# EAGLE design giraffe_mx5 (EAGLE 8.5.0)
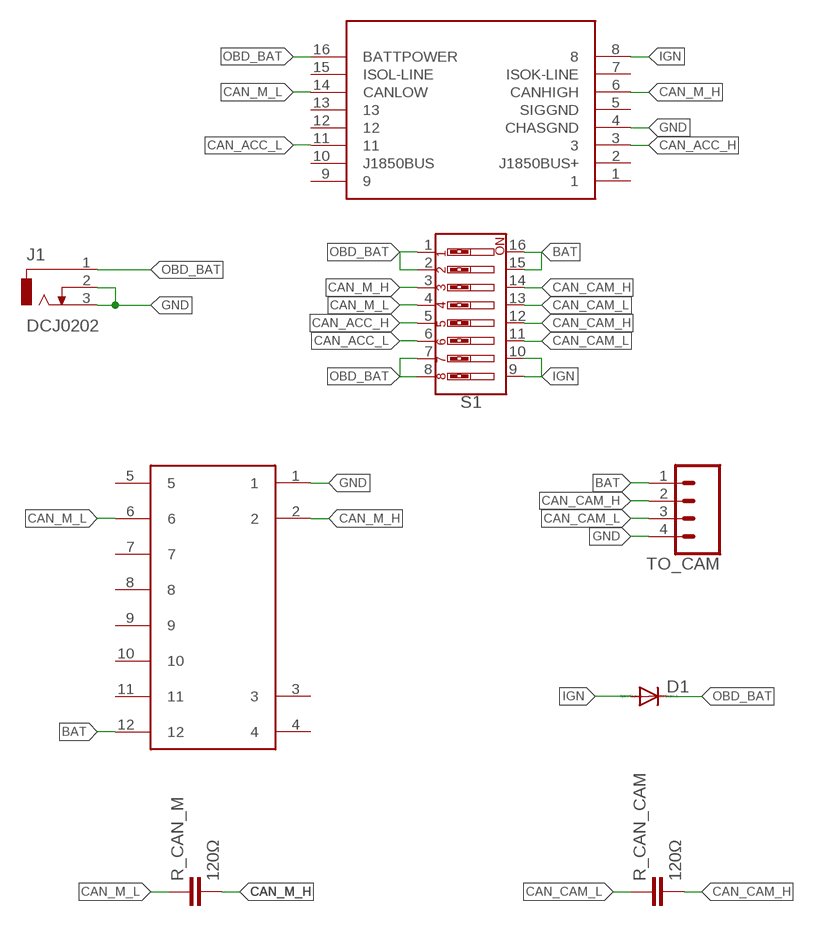
[diagram p0: schematic, sheet 1]

## Parts
D1  DIODE-DO-214AC  [DO-214AC]
J1  DCJ0202  [DCJ0202]
OBD_II  OBDII  [OBDII]
R_CAN_CAM  120Ω  C-EUC1206  [C1206]
R_CAN_M  120Ω  C-EUC1206  [C1206]
S1  DIP-08-PTH  [DIPSWITCH-08]
TO_CAM  CONN_04LONGPADS  [1X04_LONGPADS]
TO_CAR  34826-8124  [34826-8124]

## Nets
BAT: S1.15 S1.16 TO_CAM.1 TO_CAR.12
CAN_ACC_H: OBD_II.3 S1.5
CAN_ACC_L: OBD_II.11 S1.6
CAN_CAM_H: R_CAN_CAM.2 S1.12 S1.14 TO_CAM.2
CAN_CAM_L: R_CAN_CAM.1 S1.11 S1.13 TO_CAM.3
CAN_M_H: OBD_II.6(CANHIGH) R_CAN_M.2 S1.3 TO_CAR.2
CAN_M_L: OBD_II.14(CANLOW) R_CAN_M.1 S1.4 TO_CAR.6
GND: J1.2 J1.3 OBD_II.4(CHASGND) TO_CAM.4 TO_CAR.1
IGN: D1.A OBD_II.8 S1.9 S1.10
OBD_BAT: D1.C J1.1 OBD_II.16(BATTPOWER) S1.1 S1.2 S1.7 S1.8
Unconnected: OBD_II.1 OBD_II.2(J1850BUS+) OBD_II.5(SIGGND) OBD_II.7(ISOK-LINE) OBD_II.9 OBD_II.10(J1850BUS) OBD_II.12 OBD_II.13 OBD_II.15(ISOL-LINE) TO_CAR.3 TO_CAR.4 TO_CAR.5 TO_CAR.7 TO_CAR.8 TO_CAR.9 TO_CAR.10 TO_CAR.11

## Library data of the parts
D1 = diode:DIODE-: DIODE
J1 = con-jack:DCJ0202: DC POWER JACK Source: DCJ0202.pdf; OC_FARNELL: unknown; OC_NEWARK: unknown
OBD_II = SparkFun-Connectors:OBDII: OBD-II Connector OBDII is an on board diagnostics standard that is used on a large variety of cars. Here is the connector we sell at SparkFun: OBD-II connector <https://www.sparkfun.com/products/9911> (DEV-09911) Info and Pinout <http://pinoutsguide.com/CarElectronics/car_obd2_pinout.shtml> (sorry, no datasheet) We do not use this connector on any active designs, however, if you're looking for OBDII tech, please check out these: SparkFun OBD related products <https://www.sparkfun.com/search/results?term=obd>; SF_ID: DEV-09911
R_CAN_CAM R_CAN_M = resistor:C-EU: CAPACITOR, European symbol
S1 = SparkFun-Switches:DIP-08: 8-Position DIP Switch 8-circuit DIP (dual inline package) switch. Commonly used to physcially set a circuit's behavior. SparkFun Products DIP Switch - 8 Position <https://www.sparkfun.com/products/8034> (COM-08034); PROD_ID: SWCH-12197; SF_SKU: COM-08034
TO_CAM = SparkFun-Connectors:CONN_04: Multi connection point. Often used as Generic Header-pin footprint for 0.1 inch spaced/style header connections On any of the 0.1 inch spaced packages, you can populate with these: Break Away Headers - Straight <https://www.sparkfun.com/products/116> (PRT-00116) Break Away Male Headers - Right Angle <https://www.sparkfun.com/products/553> (PRT-00553) Female Headers <https://www.sparkfun.com/products/115> (PRT-00115) Break Away Headers - Machine Pin <https://www.sparkfun.com/products/117> (PRT-00117) Break Away Female Headers - Swiss Machine Pin <https://www.sparkfun.com/products/743> (PRT-00743) For SCREWTERMINALS and SPRING TERMINALS visit here: Screw Terimnals on SparkFun.com <https://www.sparkfun.com/search/results?term=Screw+Terminals> (5mm/3.5mm/2.54mm spacing) This device is also useful as a general connection point to wire up your design to another part of your project. Our various solder wires solder well into these plated through hole pads. Hook-Up Wire - Assortment (Stranded, 22 AWG) <https://www.sparkfun.com/products/11375> (PRT-11375) Hook-Up Wire - Assortment (Solid Core, 22 AWG) <https://www.sparkfun.com/products/11367> (PRT-11367) View the entire wire category on our website here <https://www.sparkfun.com/categories/141> Special notes: Molex polarized connector foot print use with SKU : PRT-08231 with associated crimp pins and housings. 1MM SMD Version SKU: PRT-10208; PROD_ID: CONN-09696
TO_CAR = Mini50:34826-8124

## Net classes
0 default: width 0.305 mm, clearance 0.305 mm

## Board
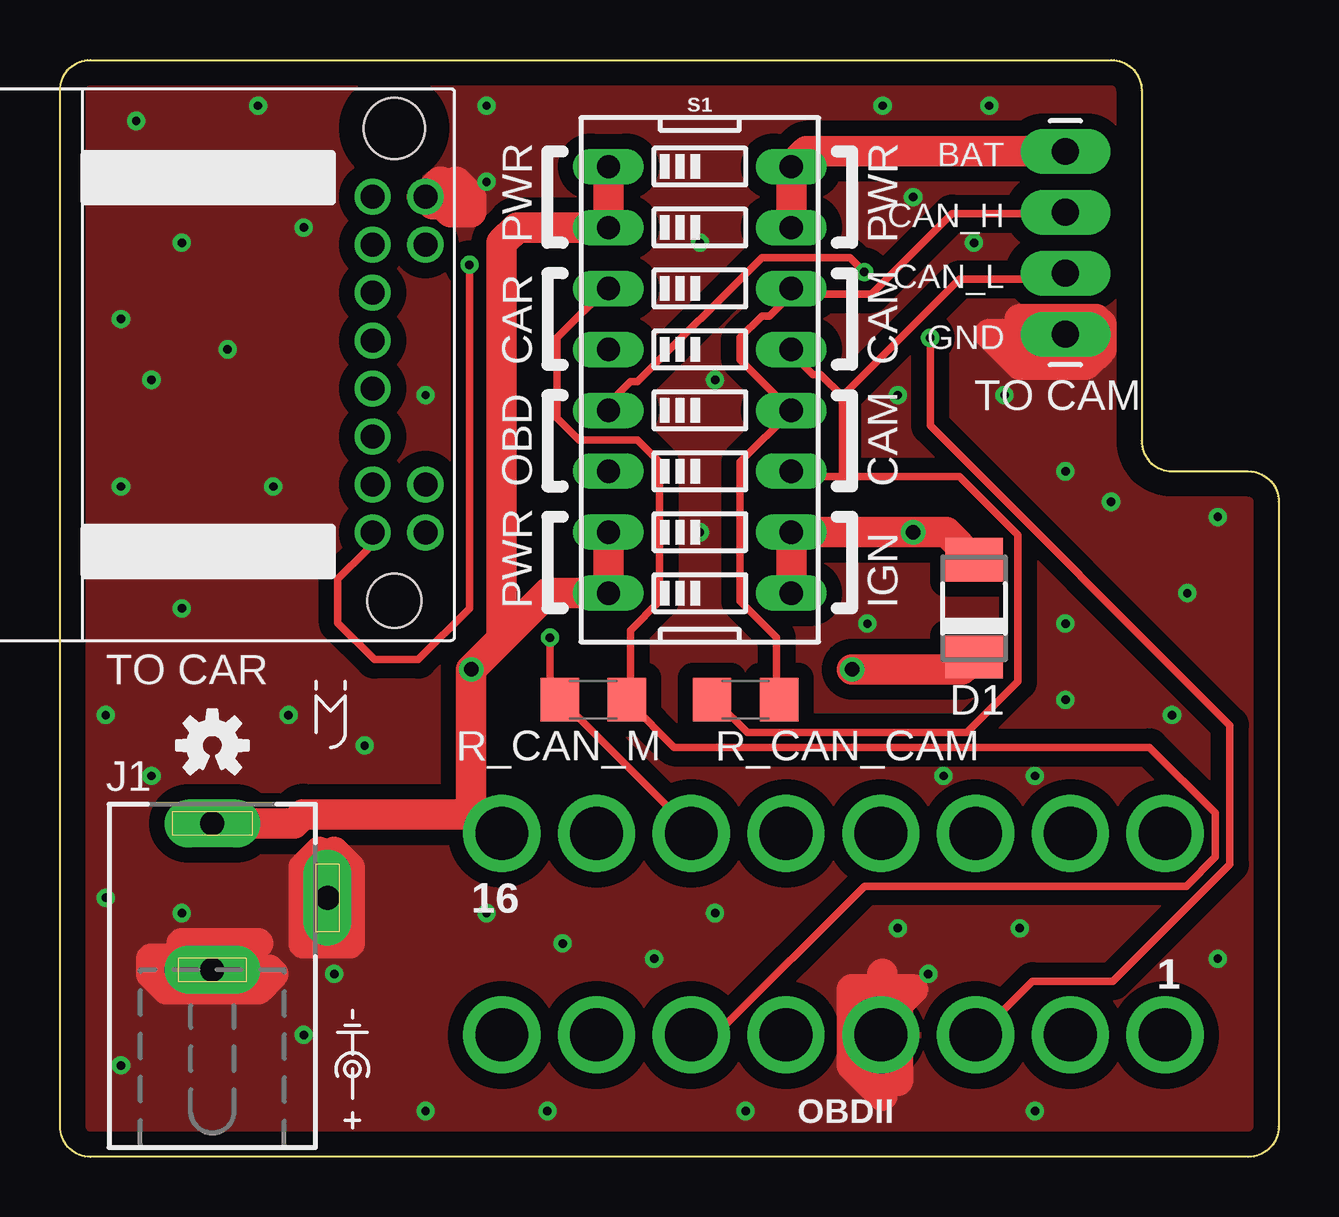
[diagram p1: board, top side]
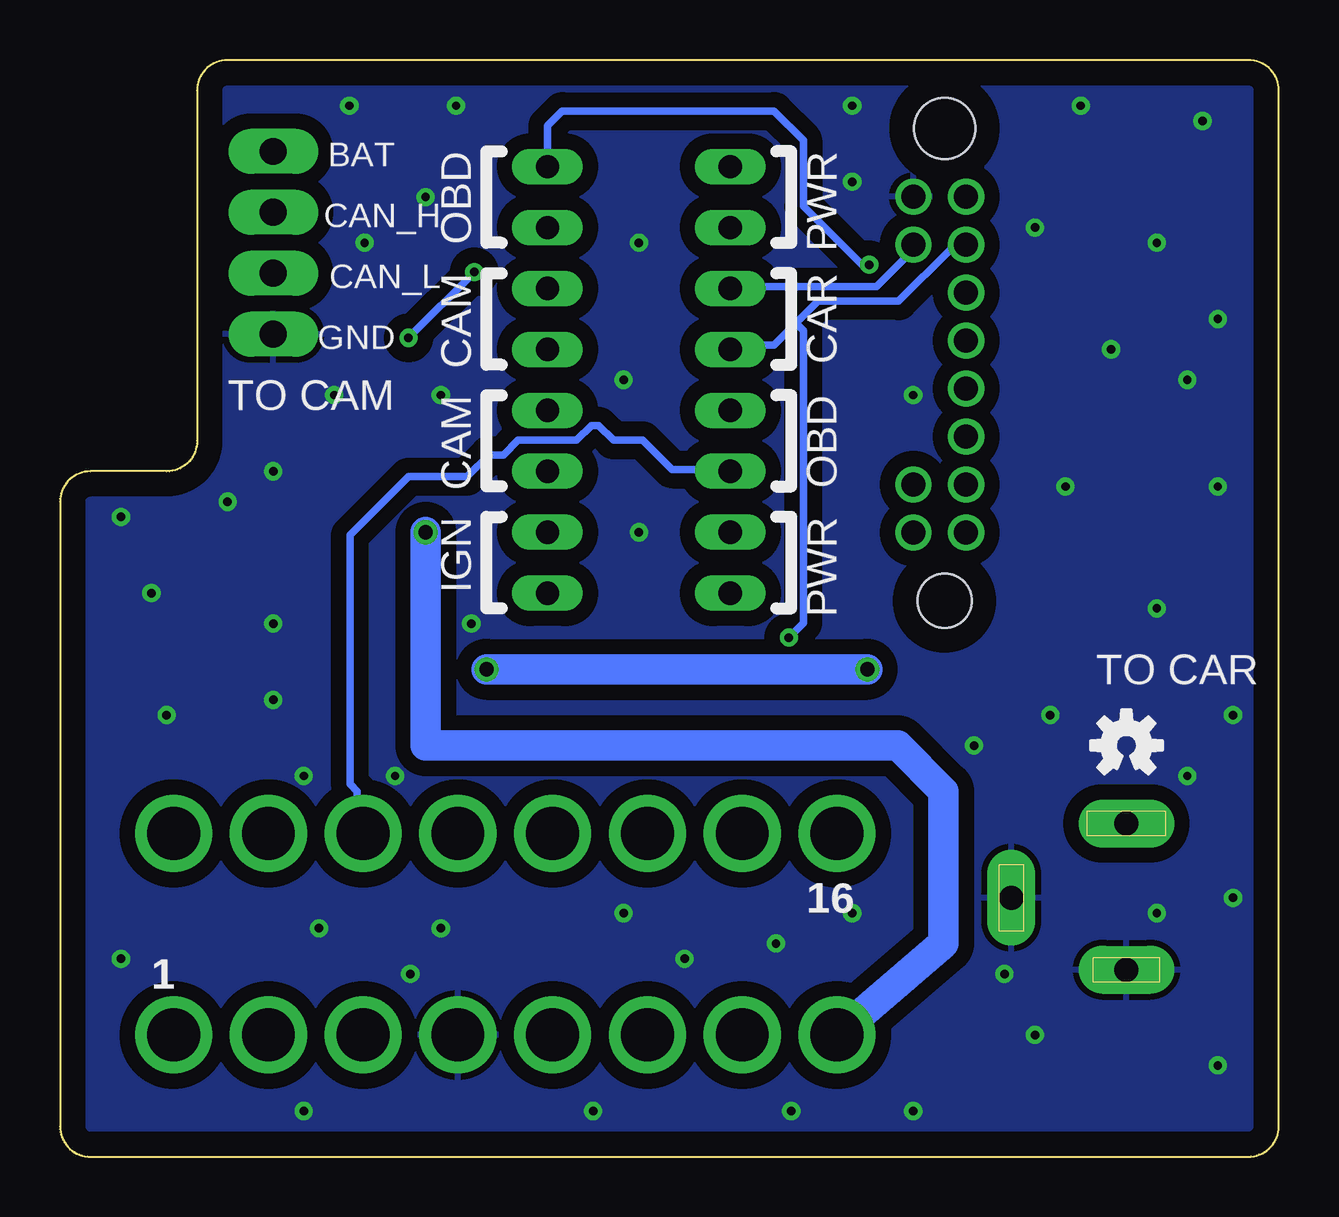
[diagram p2: board, bottom side, seen from below]

Size 50.8 x 45.72 mm. Coordinates in mm from the lower left corner, seen from the top.
Outline: 49.53,0 1.27,0 arc-90 0,1.27 0,44.45 arc-90 1.27,45.72 43.81,45.72 arc-90 45.09,44.45 45.09,29.84 arc90 46.35,28.57 49.53,28.57 arc-90 50.8,27.3 50.8,1.27 arc-90 49.53,0
Copper layers (1*16): Top 0.035mm / dielectric 2.5mm / Bottom 0.035mm
Design rules "default *": minimum track width 6mil, minimum drill 0.35mm, track to track 6mil, track to pad 6mil, pad to pad 6mil, via to via 6mil, smd to smd 6mil, copper to edge 40mil, drill to drill 6mil, minimum pad ring 10mil, minimum via ring 8mil, stop-mask expansion 4mil, vias tented up to drill 0mil, thermal gap 10mil

### Footprints (pad centres in the part's own frame; a part is rotated, then mirrored left to right if it is on the bottom)
DO-214AC = smd 1.8 x 2.4: A 2.025,0; C -2.025,0
DCJ0202 = drill 1 pad 2 long: 1 0,3.1; 2 4.8,0; 3 0,-3
OBDII = drill 2.2: 1 13.68,-3.81; 2 9.73,-3.81; 3 5.78,-3.81; 4 1.83,-3.81; 5 -2.12,-3.81; 6 -6.07,-3.81; 7 -10.02,-3.81; 8 -13.97,-3.81; 9 13.68,4.59; 10 9.73,4.59; 11 5.78,4.59; 12 1.83,4.59; 13 -2.12,4.59; 14 -6.07,4.59; 15 -10.02,4.59; 16 -13.97,4.59
C1206 = smd 1.6 x 1.8: 1 -1.4,0; 2 1.4,0
DIPSWITCH-08 = drill 0.97 long: 1 -8.89,-3.81; 2 -6.35,-3.81; 3 -3.81,-3.81; 4 -1.27,-3.81; 5 1.27,-3.81; 6 3.81,-3.81; 7 6.35,-3.81; 8 8.89,-3.81; 9 8.89,3.81; 10 6.35,3.81; 11 3.81,3.81; 12 1.27,3.81; 13 -1.27,3.81; 14 -3.81,3.81; 15 -6.35,3.81; 16 -8.89,3.81
1X04_LONGPADS = drill 1.118 pad 1.88 long: 1 0,0; 2 2.54,0; 3 5.08,0; 4 7.62,0
34826-8124 = drill 1 pad 1.5: 1 -7,3.8; 2 -5,3.8; 3 5,3.8; 4 7,3.8; 5 -7,1.6; 6 -5,1.6; 7 -3,1.6; 8 -1,1.6; 9 1,1.6; 10 3,1.6; 11 5,1.6; 12 7,1.6 | hole 2.55: -9.85,2.5 | hole 2.25: 9.85,2.5

### Placement (x,y rotation side)
D1  38.1,22.86 90 top
J1  6.35,10.79 0 top
OBD_II  32.38,8.89 0 top
R_CAN_CAM  28.57,19.05 0 top
R_CAN_M  22.23,19.05 0 top
S1  26.67,32.38 270 top
TO_CAM  41.91,41.91 270 top
TO_CAR  11.43,33.02 270 top
U$1  [OSHW-LOGO-S]  6.35,17.14 0 top
U$2  [OSHW-LOGO-S]  6.35,17.14 0 bottom

### Tracks (layer width: path | path; a pad name or v marks a point on that pad's centre or on a via)
BAT  (via drill 0.35)
  Top 0.305: v17.07,37.19 17.07,22.86 14.94,20.73 13.11,20.73 11.58,22.25 11.58,24.08 12.8,25.3 12.8,25.91 TO_CAR.12
  Top 1.27: TO_CAM.1 31.11,41.91 S1.16 S1.15
  Bottom 0.305: v17.07,37.19 17.37,37.19 19.81,39.62 19.81,42.37 21.03,43.59 29.87,43.59 30.48,42.98 S1.16
CAN_ACC_H  (via drill 0.35)
  Top 0.305: v33.53,36.88 32.92,37.49 29.26,37.49 24.08,32.31 23.77,32.31 22.86,31.39 S1.5 | v36.27,34.14 36.27,30.48 48.77,17.98 48.77,12.19 43.89,7.32 40.54,7.32 38.41,5.18 OBD_II.3
  Bottom 0.305: v36.27,34.14 v33.53,36.88
CAN_ACC_L
  Bottom 0.305: S1.6 22.86,28.65 25.3,28.65 26.52,29.87 27.74,29.87 28.35,30.48 28.65,30.48 29.26,29.87 31.7,29.87 32.31,29.26 32.92,29.26 33.83,28.35 36.27,28.35 38.71,25.91 38.71,15.54 38.41,15.24 38.41,13.72 OBD_II.11
CAN_CAM_H
  Top 0.305: 30.48,31.09 28.35,28.96 28.35,23.16 29.87,21.64 29.87,19.2 R_CAN_CAM.2 | 30.48,35.97 29.57,35.05 29.26,35.05 28.35,34.14 28.35,33.22 30.48,31.09 | 30.48,31.09 S1.12 | 30.48,35.97 33.83,35.97 37.19,39.32 41.76,39.32 TO_CAM.2 | 30.48,35.97 S1.14
CAN_CAM_L
  Top 0.305: 32.61,28.35 30.48,28.35 S1.11 | 32.61,28.35 37.49,28.35 39.93,25.91 39.93,19.81 37.8,17.68 28.65,17.68 27.43,18.9 R_CAN_CAM.1 | 32.61,31.7 31.7,32.61 31.39,32.61 30.48,33.53 S1.13 | 32.61,28.35 32.61,31.7 | 32.61,31.7 37.49,36.58 41.76,36.58 TO_CAM.3
CAN_M_H
  Top 0.305: S1.3 22.86,36.27 20.73,34.14 20.73,30.79 21.64,29.87 24.08,29.87 24.99,28.96 24.99,23.16 23.77,21.95 23.77,19.2 R_CAN_M.2 23.77,18.9 25.6,17.07 45.41,17.07 48.16,14.33 48.16,12.5 46.94,11.28 33.53,11.28 27.43,5.18 26.52,5.18 OBD_II.6
  Bottom 0.305: TO_CAR.2 15.24,37.8 16.76,36.27 22.86,36.27 S1.3
CAN_M_L  (via drill 0.35)
  Top 0.305: OBD_II.14 26.21,13.72 21.03,18.9 R_CAN_M.1 20.73,19.2 20.42,19.51 v20.42,21.64
  Bottom 0.305: 20.12,34.75 19.2,35.66 15.85,35.66 13.72,37.8 13.11,37.8 TO_CAR.6 | 20.12,34.75 21.03,33.83 22.86,33.83 S1.4 | 20.12,34.75 19.81,34.44 19.81,22.25 v20.42,21.64
GND  (via drill 0.35)
  Top 1.27: TO_CAM.4 38.73,34.29 40.01,33.02 42.76,33.02 43.4,33.66 43.4,34.71 43.18,34.92 40.01,34.92 | OBD_II.4 34.29,5.16 | 34.29,5.16 34.29,7.62 | 34.29,5.16 34.29,2.54 33.02,3.81 33.02,6.99 35.56,6.99 34.92,6.35 34.92,3.17 | J1.3 8.71,7.79 8.89,7.62 8.26,6.99 4.45,6.99 3.81,7.62 3.81,8.26 6.99,8.26 7.62,8.89 | 7.62,8.89 8.26,8.89 | 7.62,8.89 5.08,8.89 | TO_CAR.1 15.54,39.71 15.93,39.71 16.27,39.37 17.14,39.37 17.14,40.01 16.51,40.64 15.89,40.02 TO_CAR.1 | TO_CAR.1 15.85,40.64 15.88,40.64 | J1.2 11.15,12.35 10.79,12.7 10.16,12.06 10.16,8.89 12.06,8.89 12.06,12.06 11.43,12.7
  other vias: 3.17,43.18 5.08,38.1 2.54,34.92 3.81,32.38 2.54,27.94 5.08,22.86 1.91,18.41 3.81,15.88 1.91,10.79 5.08,10.16 2.54,3.81 10.16,5.08 9.53,18.41 8.89,27.94 6.99,33.66 10.16,38.73 8.26,43.81 17.78,43.81 34.29,43.81 38.73,43.81 35.56,40.01 38.1,38.1 34.92,31.75 39.37,31.75 41.91,28.57 43.81,27.3 46.99,23.5 48.26,26.67 41.91,19.05 41.91,22.23 46.35,18.41 40.64,15.88 33.66,22.23 26.67,26.04 27.3,32.38 26.67,38.1 17.78,40.64 15.24,31.75 12.7,17.14 11.43,7.62 20.95,8.89 17.78,10.16 27.3,10.16 24.77,8.26 36.2,7.62 34.92,9.53 40.01,9.53 48.26,8.26 40.64,1.91 28.57,1.91 20.32,1.91 15.24,1.91 36.83,15.88
  pour Top (isolate 0.635): -1.27,46.99 45.09,46.99 45.09,29.84 52.07,29.84 52.07,-1.27 -1.27,-1.27
  pour Bottom (isolate 0.635): -2.54,48.26 -2.54,-2.54 53.98,-2.54 53.98,31.11 46.35,31.11 46.35,48.26
IGN  (via drill 0.6)
  Top 1.27: D1.A 36.95,26.04 v35.56,26.04 S1.10 S1.9
  Bottom 1.27: v35.56,26.04 35.56,17.14 15.88,17.14 13.97,15.24 13.97,8.89 OBD_II.8
OBD_BAT  (via drill 0.6)
  Top 1.27: J1.1 9.76,13.89 10.14,14.28 17.14,14.28 | 17.14,14.28 17.62,14.28 OBD_II.16 | S1.7 S1.8 20.32,23.5 18.41,21.59 | 18.41,21.59 v17.14,20.32 17.14,14.28 | 18.41,21.59 18.41,38.1 19.05,38.73 S1.2 S1.1 | D1.C 37.59,20.32 v33.02,20.32
  Bottom 1.27: v33.02,20.32 v17.14,20.32

### Text on the board
tNames: BAT | CAN_H | PWR | PWR | CAN_L | GND | CAR | CAM | TO CAM | OBD | CAM | PWR | IGN | TO CAR
bNames: PWR | OBD | BAT | CAN_H | CAR | CAM | CAN_L | GND | OBD | CAM | TO CAM | PWR | IGN | TO CAR